# Altium schematic sheet 上层控制板.SchDoc
size A3; SheetNumber: 1; SheetTotal: 3
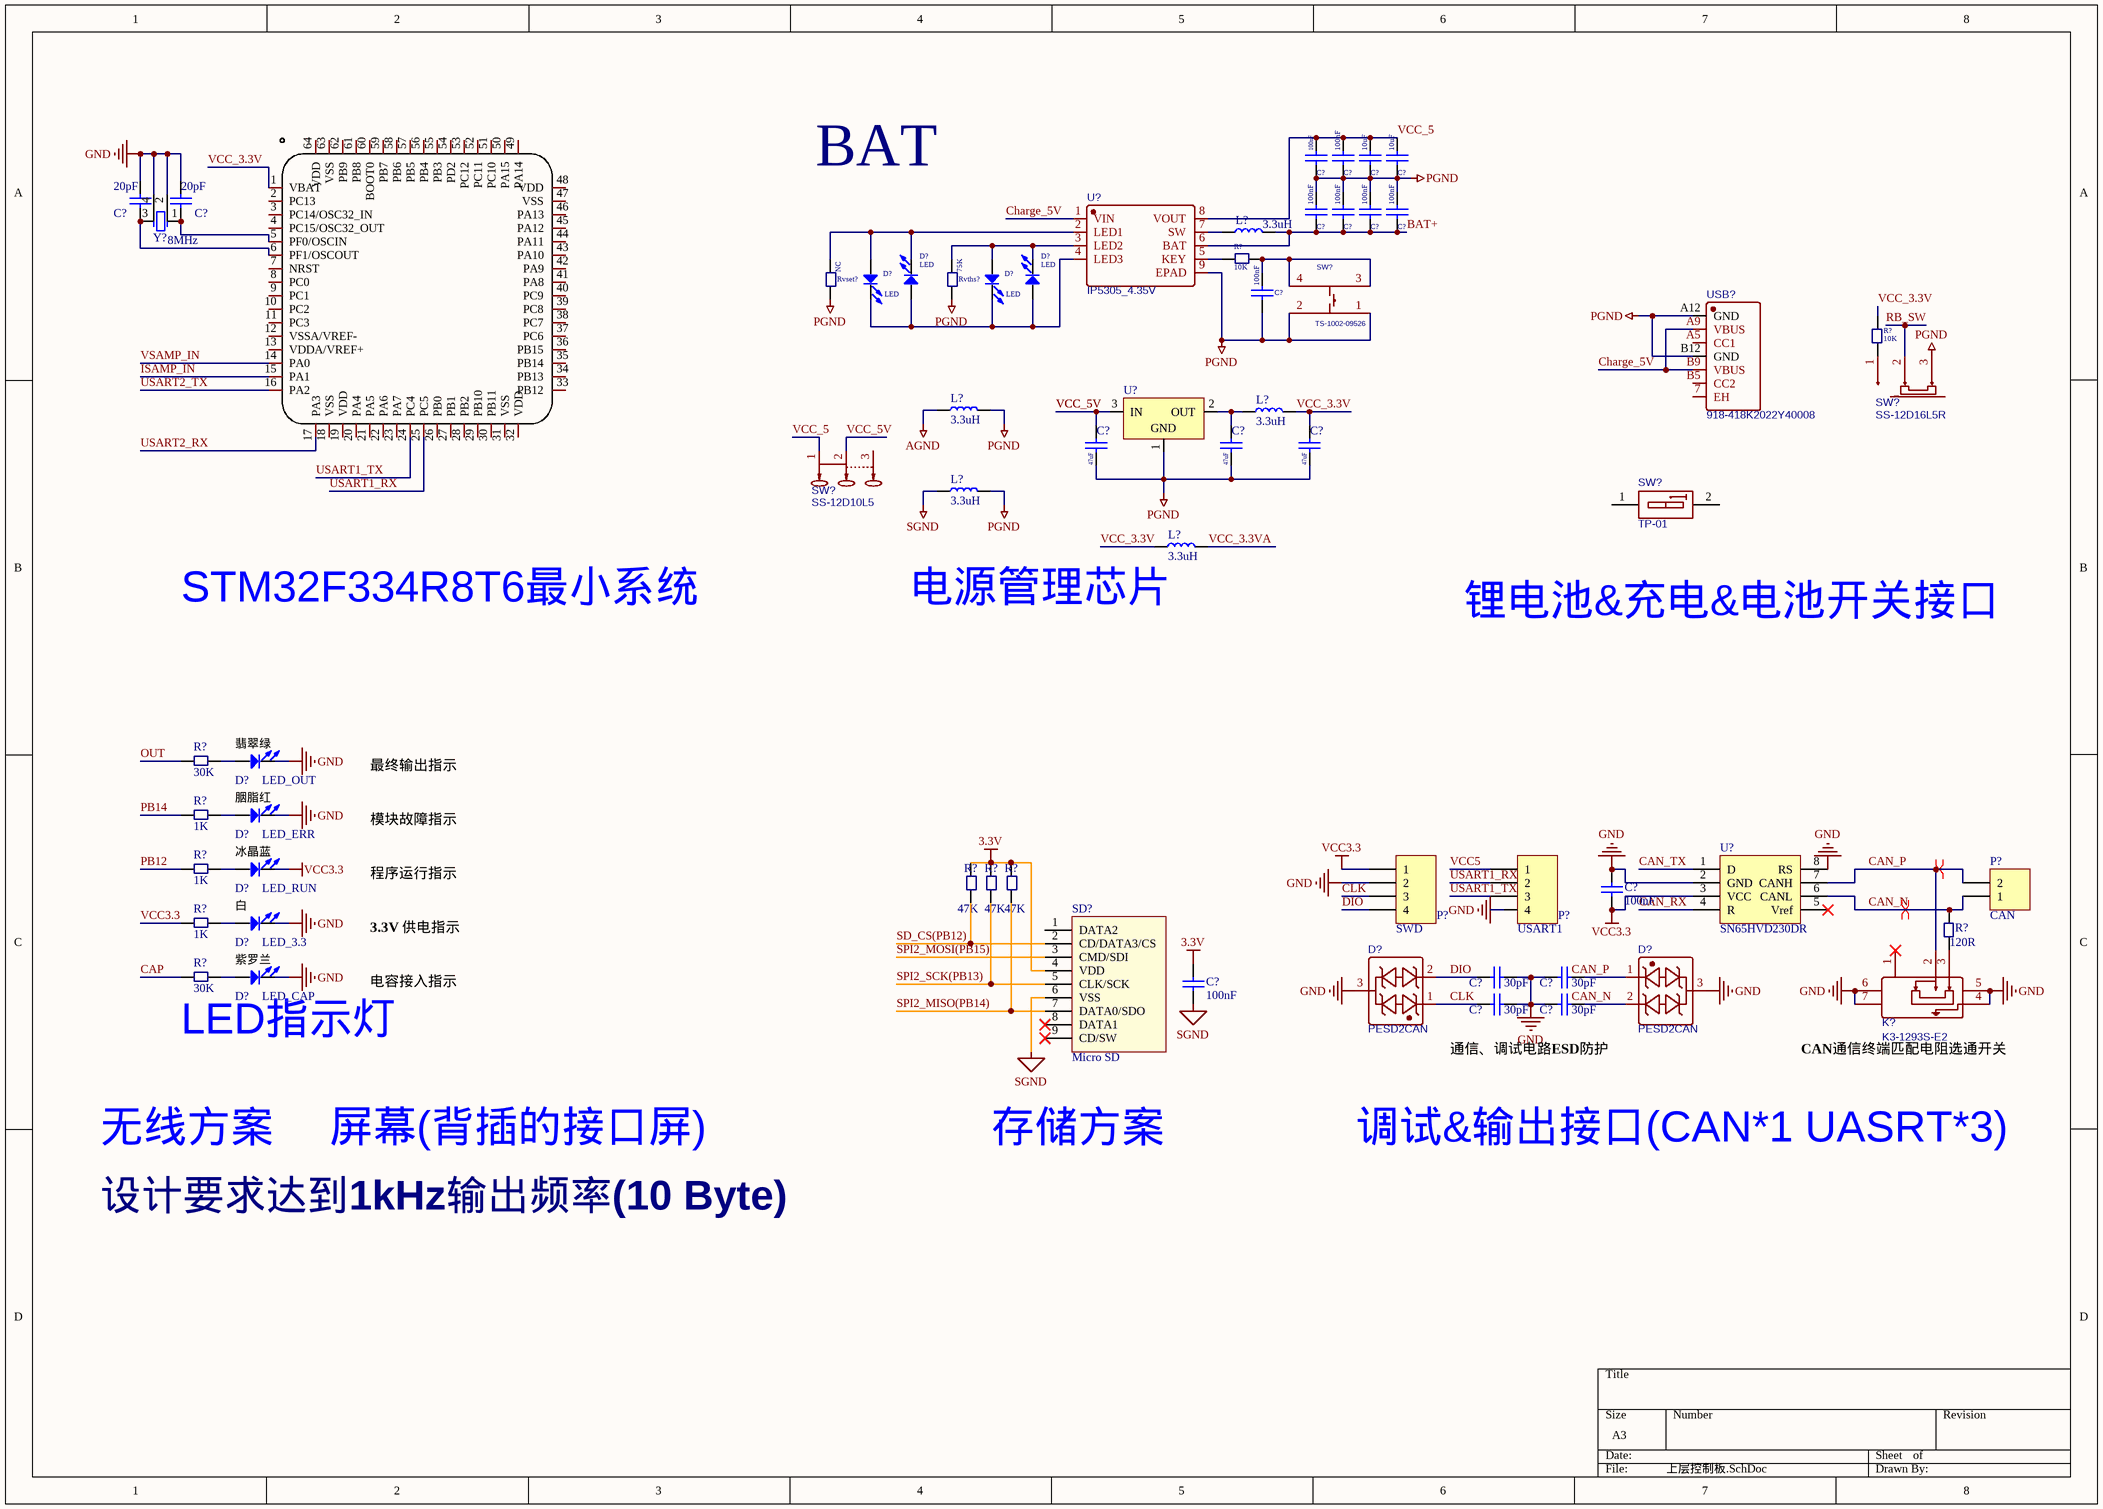
[diagram p0: 上层控制板.SchDoc]

## Parts
(Parts that share a designator on the sheet are numbered #1, #2 ... from top to bottom, then left to right.)
C?#1  100nF  [C_0603]
C?#2  100nF  [C_0603]
C?#3  10uF  [C_0603]
C?#4  10uF  [C_0603]
C?#5  20pF  [C_0603]
C?#6  20pF  [C_0603]
C?#7  100nF  [C_0603]
C?#8  100nF  [C_0603]
C?#9  100nF  [C_0603]
C?#10  100nF  [C_0603]
C?#11  100nF  [C_0603]
C?#12  47uF  [C_0603]
C?#13  47uF  [C_0603]
C?#14  47uF  [C_0603]
C?#15  100nF  [C_0603]
C?#16  30pF  [C_0603]
C?#17  100nF  [C_0402]
C?#18  30pF  [C_0603]
C?#19  30pF  [C_0603]
C?#20  30pF  [C_0603]
D?#1  LED  [D_SOD_323]
D?#2  LED  [D_SOD_323]
D?#3  LED  [D_SOD_323]
D?#4  LED  [D_SOD_323]
D?#5  LED_OUT  [D_SOD_323]
D?#6  LED_ERR  [D_SOD_323]
D?#7  LED_RUN  [D_SOD_323]
D?#8  LED_3.3  [D_SOD_323]
D?#9  LED_CAP  [D_SOD_323]
D?#10  PESD2CAN  [SOT-23-3_L2.9-W1.3-P1.90-LS2.4-BR]
D?#11  PESD2CAN  [SOT-23-3_L2.9-W1.3-P1.90-LS2.4-BR]
K?  K3-1293S-E2  [SW-TH_MSK12C02]
L?#1  3.3uH  [IND-SMD_L7.1-W6.6]
L?#2  3.3uH  [L_0805]
L?#3  3.3uH  [L_0805]
L?#4  3.3uH  [L_0805]
L?#5  3.3uH  [L_0805]
P?#1  SWD  [BM04B-GHS-TBT]
P?#2  USART1  [BM04B-GHS-TBT]
P?#3  CAN  [BM02B-GHS-TBT]
R?#1  10K  [R_0603]
R?#2  10K  [R_0603]
R?#3  30K  [R_0603]
R?#4  1K  [R_0603]
R?#5  1K  [R_0603]
R?#6  47K  [R_0402]
R?#7  47K  [R_0402]
R?#8  47K  [R_0402]
R?#9  1K  [R_0603]
R?#10  120R  [R_0603]
R?#11  30K  [R_0603]
Rvset?  NC  [R_0603]
Rvths?  75K  [R_0603]
SD?  Micro SD  [MICRO SD]
SW?#1  TS-1002-09526  [SW-TH_4P-L6.0-W6.0-P4.50-LS6.5]
SW?#2  SS-12D16L5R  [SW-TH_SS-12D16L5R]
SW?#3  SS-12D10L5  [SW-TH_SS-12D10L5]
SW?#4  TP-01  [SW-SMD_2P-L2.8-W5.4-P1.27-LS8.5]
U?#1  IP5305_4.35V  [SOP-8_L4.9-W3.9-P1.27-LS6.0-BL-EP]
U?#2  STM32F334R8T6  [LQFP-64_L10.0-W10.0-P0.50-LS12.0-BL]  (value not drawn)
U?#3  LM1117-3.3  [SOT_223]  (value not drawn)
U?#4  SN65HVD230DR  [SOIC127P600X175-8N]
USB?  918-418K2022Y40008  [USB-C-SMD_918-418K2022Y40008]
Y?  8MHz  [XTAL_3225]

## Nets
3.3V: C?#17.2 R?#6.2 R?#7.2 R?#8.2 SD?.4(VDD)
AGND: L?#2.1
GND: C?#5.1 C?#6.1 C?#15.2 C?#16.2 C?#18.2 C?#19.2 C?#20.2 D?#5.2(K) D?#6.2(K) D?#8.2(K) D?#9.2(K) D?#10.3 D?#11.3 K?.4 K?.5 K?.6 K?.7 P?#1.2 P?#2.4 U?#4.2(GND) U?#4.8(RS) Y?.2 Y?.4
PGND: C?#1.1 C?#2.1 C?#3.1 C?#4.1 C?#7.2 C?#8.2 C?#9.2 C?#10.2 C?#11.1 C?#12.1 C?#13.1 C?#14.1 L?#2.2 L?#4.2 Rvset?.1 Rvths?.1 SW?#1.1 SW?#1.2 SW?#2.3 U?#1.9(EPAD) U?#3.1(GND) USB?.A12(GND) USB?.B12(GND)
SGND: C?#17.1 L?#4.1 SD?.6(VSS)
VCC3.3: C?#15.1 D?#7.2(K) P?#1.1 R?#9.2 U?#4.3(VCC)
BAT+: C?#7.1 C?#8.1 C?#9.1 C?#10.1 L?#1.2 U?#1.6(BAT)
CAN_N: P?#3.2(1) R?#10.1 U?#4.6(CANL)
CAN_P: K?.2 P?#3.1(2) U?#4.7(CANH)
CAN_RX: U?#4.4(R)
CAN_TX: U?#4.1(D)
CAP: R?#11.2
Charge_5V: U?#1.1(VIN) USB?.A9(VBUS) USB?.B9(VBUS)
CLK: C?#18.1 D?#10.1 P?#1.3
DIO: C?#16.1 D?#10.2 P?#1.4
ISAMP_IN: U?#2.15(PA1)
OUT: R?#3.2
PB12: R?#5.2
PB14: R?#4.2
RB_SW: SW?#2.2
SD_CS(PB12): R?#6.1 SD?.2(CD/DATA3/CS)
SPI2_MISO(PB14): R?#8.1 SD?.7(DATA0/SDO)
SPI2_MOSI(PB15): SD?.3(CMD/SDI)
SPI2_SCK(PB13): R?#7.1 SD?.5(CLK/SCK)
USART1_RX: P?#2.2 U?#2.25(PC5)
USART1_TX: P?#2.3 U?#2.24(PC4)
USART2_RX: U?#2.17(PA3)
USART2_TX: U?#2.16(PA2)
VCC5: P?#2.1
VCC_3.3V: C?#14.2 L?#3.2 L?#5.1 R?#2.1 U?#2.1(VBAT)
VCC_3.3VA: L?#5.2
VCC_5: C?#1.2 C?#2.2 C?#3.2 C?#4.2 SW?#3.1 U?#1.8(VOUT)
VCC_5V: C?#12.2 SW?#3.2 U?#3.3(IN)
VSAMP_IN: U?#2.14(PA0)
NetC?#5_2: C?#5.2 U?#2.6(PF1/OSCOUT) Y?.3(OSC2)
NetC?#6_2: C?#6.2 U?#2.5(PF0/OSCIN) Y?.1(OSC1)
NetC?#11_2: C?#11.2 R?#1.1 SW?#1.3 SW?#1.4
NetC?#13_2: C?#13.2 L?#3.1 U?#3.2(OUT)
NetC?#19_1: C?#19.1 D?#11.1
NetC?#20_1: C?#20.1 D?#11.2
NetD?#1_1: D?#1.1(A) D?#3.2(K) Rvset?.2 U?#1.2(LED1)
NetD?#1_2: D?#1.2(K) D?#2.2(K) D?#3.1(A) D?#4.1(A) U?#1.4(LED3)
NetD?#2_1: D?#2.1(A) D?#4.2(K) Rvths?.2 U?#1.3(LED2)
NetD?#5_1: D?#5.1(A) R?#3.1
NetD?#6_1: D?#6.1(A) R?#4.1
NetD?#7_1: D?#7.1(A) R?#5.1
NetD?#8_1: D?#8.1(A) R?#9.1
NetD?#9_1: D?#9.1(A) R?#11.1
NetK?_3: K?.3 R?#10.2
NetL?#1_1: L?#1.1 U?#1.7(SW)
NetR?#1_2: R?#1.2 U?#1.5(KEY)
NetR?#2_2: R?#2.2 SW?#2.1

Not connected (* = marked no-connect by the designer): K? 1*; SD? 1(DATA2) 8(DATA1)* 9(CD/SW)*; SW?#3 3; SW?#4 1(A1) 2(A2); U?#2 2(PC13) 3(PC14/OSC32_IN) 4(PC15/OSC32_OUT) 7(NRST) 8(PC0) 9(PC1) 10(PC2) 11(PC3) 12(VSSA/VREF-) 13(VDDA/VREF+) 18(VSS) 19(VDD) 20(PA4) 21(PA5) 22(PA6) 23(PA7) 26(PB0) 27(PB1) 28(PB2) 29(PB10) 30(PB11) 31(VSS) 32(VDD) 33(PB12) 34(PB13) 35(PB14) 36(PB15) 37(PC6) 38(PC7) 39(PC8) 40(PC9) 41(PA8) 42(PA9) 43(PA10) 44(PA11) 45(PA12) 46(PA13) 47(VSS) 48(VDD) 49(PA14) 50(PA15) 51(PC10) 52(PC11) 53(PC12) 54(PD2) 55(PB3) 56(PB4) 57(PB5) 58(PB6) 59(PB7) 60(BOOT0) 61(PB8) 62(PB9) 63(VSS) 64(VDD); U?#4 5(Vref)*; USB? 7(EH) A5(CC1) B5(CC2)

## Layout directives
differential pair: CAN_P
differential pair; rule Undefined: CAN_N

## Notes on the sheet
- BAT
- STM32F334R8T6最小系统
- 电源管理芯片
- 锂电池&充电&电池开关接口
- (near D?#5) 翡翠绿
- 最终输出指示
- (near D?#6) 胭脂红
- (near D?#7) 冰晶蓝
- 模块故障指示
- (near D?#8) 白
- 程序运行指示
- (near D?#9) 紫罗兰
- 3.3V 供电指示
- 电容接入指示
- LED指示灯
- (near C?#18) 通信、调试电路ESD防护
- (near K?) CAN通信终端匹配电阻选通开关
- 无线方案
- 屏幕(背插的接口屏)
- 存储方案
- 调试&输出接口(CAN*1 UASRT*3)
- 设计要求达到1kHz输出频率(10 Byte)
- Labels drawn without touching a wire or pin: CAN_N, CAN_P

## Library data of the parts
C?#1-C?#20 = Cap: Capacitor; Published: 8-Jun-2000; LatestRevisionDate: 17-Jul-2002; LatestRevisionNote: Re-released for DXP Platform.; PackageReference: RAD-0.3; Publisher: Altium Limited; PackageDescription: Radial Cap, Thru-Hole; 2 Leads; 0.3 in Pin Spacing
D?#1-D?#9 = LED: Typical INFRARED GaAs LED; Published: 8-Jun-2000; LatestRevisionDate: 08-Jul-2005; LatestRevisionNote: Mech Layer 1 removed.; PackageReference: LED-0; Publisher: Altium Limited; PackageDescription: LED; 2 Leads
D?#10 D?#11 = PESD2CAN_C907830: BOM_Manufacturer: TECH PUBLIC; Contributor: LCSC; BOM_Supplier: LCSC; BOM_Supplier Part: C907830; BOM_Manufacturer Part: PESD2CAN; BOM_JLCPCB Part Class: Extended Part; spicePre: D; spiceSymbolName: PESD2CAN_C907830
K? = MSK12C02: BOM_Manufacturer: SHOU HAN; Contributor: LCSC; BOM_Supplier: LCSC; BOM_Supplier Part: C431540; BOM_Manufacturer Part: MSK12C02; BOM_JLCPCB Part Class: Extended Part; spicePre: S; spiceSymbolName: MSK12C02
L?#1-L?#5 = Inductor: Code_IEC: 1005; Published: 8-Jun-2000; LatestRevisionDate: 17-Jul-2002; LatestRevisionNote: Re-released for DXP Platform.; PackageReference: 0402-A; Publisher: Altium Limited; Code_JEITA: 0402
P?#1 P?#2 = Header 4: SM04B-GHS-TB; LatestRevisionDate: 17-Jul-2002; LatestRevisionNote: Re-released for DXP Platform.; Publisher: Altium Limited
P?#3 = Header 2: SM02B-GHS-TB; LatestRevisionDate: 17-Jul-2002; LatestRevisionNote: Re-released for DXP Platform.; Publisher: Altium Limited
R?#1 R?#2 R?#6-R?#8 Rvset? Rvths? = Res2: Resistor; Published: 8-Jun-2000; LatestRevisionDate: 17-Jul-2002; LatestRevisionNote: Re-released for DXP Platform.; PackageReference: AXIAL-0.4; Publisher: Altium Limited
R?#3-R?#5 R?#9-R?#11 = Res: Resistor; Published: 8-Jun-2000; LatestRevisionDate: 17-Jul-2002; LatestRevisionNote: Re-released for DXP Platform.; PackageReference: AXIAL-0.4; Publisher: Altium Limited
SD? = Micro SD: Micro SD卡; 版权归属: 源创客; BOM名称: Micro SD卡; 学习资源: www.ooocke.com
SW?#1 = TS-1002-09526: BOM_Manufacturer: XUNPU; Contributor: LCSC; BOM_Supplier: LCSC; BOM_Supplier Part: C455100; BOM_Manufacturer Part: TS-1002-09526; BOM_JLCPCB Part Class: Extended Part; spicePre: S; spiceSymbolName: TS-1002-09526
SW?#2 = SS-12D16L5R: BOM_Manufacturer: XKB Enterprise; Contributor: LCSC; BOM_Supplier: LCSC; BOM_Supplier Part: C388634; BOM_Manufacturer Part: SS-12D16L5R; BOM_JLCPCB Part Class: Extended Part; spicePre: S; spiceSymbolName: SS-12D16L5R
SW?#3 = SS-12D10L5: BOM_Manufacturer: XKB Enterprise; Contributor: LCSC; BOM_Supplier: LCSC; BOM_Supplier Part: C319012; BOM_Manufacturer Part: SS-12D10L5; BOM_JLCPCB Part Class: Extended Part; spicePre: S; spiceSymbolName: SS-12D10L5
SW?#4 = SW_TP-01: BOM_Manufacturer: Yuandi; Contributor: LCSC; BOM_Supplier: LCSC; BOM_Supplier Part: C559164; BOM_Manufacturer Part: TP-01; BOM_JLCPCB Part Class: Extended Part; spicePre: S; spiceSymbolName: TP-01
U?#1 = IP5305_4.35V: BOM_Manufacturer: INJOINIC; Contributor: LCSC; BOM_Supplier: LCSC; BOM_Supplier Part: C180942; BOM_Manufacturer Part: IP5305_4.35V; BOM_JLCPCB Part Class: Extended Part; spicePre: U; spiceSymbolName: IP5305_4.35V
U?#2 = U STM32F334R8T6: Manufacturer: ST(意法半导体); Add into BOM: yes; CPU Core: ARM Cortex-M4; Maximum Frequency: 72MHz; Supply Voltage Range: 2V~3.6V; Internal Oscillator: 有; Program FLASH Size: 64K@x8bit; RAM Size: 12KB; GPIO Ports Number: 51; ADC (Units/Channels/bits): 1@x21ch/12bit; DAC (Units/Channels/bits): 1@x3ch/12bit; Peripherals / Functions / Protocol Stacks: DMA；看门狗；POR；PWM; Name: STM32F334R8T6; Symbol: STM32F334R8T6; Device: STM32F334R8T6; LCSC Part Name: ARM Cortex-M4 72MHz 闪存：64K@x8bit RAM：12KB; Supplier Part: C80577; Manufacturer Part: STM32F334R8T6; Supplier Footprint: LQFP-64(10x10); JLCPCB Part Class: Extended Part; Datasheet: https://atta.szlcsc.com/upload/public/pdf/source/20170712/C80577_1499832474154814708.pdf; Supplier: LCSC; Convert to PCB: yes; EEPROM/Data FLASH Size: -; Operating Temperature Range: -40℃~+85℃
U?#3 = LM1117-3.3: 800mA Low-Dropout Linear Regulator, 3-pin TO-220; PartNumber: LM1117T-3.3; Manufacturer: National Semiconductor; PackageTopMarking: NSUZXYTTE#*LM1117T*3.3; PowerWise: N; CompType: LDO IC; Published: 4-Dec-2008; DatasheetVersion: Apr-2006; PackageVersion: revL, Jan-1992; PackageReference: T03B; Publisher: Altium Limited; PackageDescription: TO-220, Molded, 3 Lead, Straight; Supplier 1: Farnell; Supplier Part Number 1: 9485813; RoHS: N; PinCount: 3; ComponentLink1Description: LM1117 Datasheet; ComponentLink1URL: http://www.national.com/ds/LM/LM1117.pdf; ComponentLink2Description: LM1117 Web Page; ComponentLink2URL: http://www.national.com/pf/LM/LM1117.html; ComponentLink3Description: T03B Package Page; ComponentLink3URL: http://www.national.com/packaging/folders/t03b.html
U?#4 = SN65HVD230
USB? = TYPEC1: BOM_Manufacturer: 精拓金; Contributor: LCSC; BOM_Supplier: LCSC; BOM_Supplier Part: C399937; BOM_Manufacturer Part: 918-418K2022Y40008; BOM_JLCPCB Part Class: Extended Part; spicePre: U; spiceSymbolName: 918-418K2022Y40008
Y? = XTAL_4: 8MHz/3225无源; Published: 8-Jun-2000; LatestRevisionDate: 17-Jul-2002; LatestRevisionNote: Re-released for DXP Platform.; PackageReference: R38; Publisher: Altium Limited